# Altium schematic sheet mboard.SchDoc: =GlobalProjectName
size 410 x 297 mm; SheetNumber: 1; SheetTotal: 2; PageSetup: Record=PageOptions|CenterHorizontal=True|CenterVertical=True|PrintScale=1.00|XCorrection=1.00|YCorrection=1.00|PrintKind=1|BorderSize=5000000|LeftOffset=0|BottomOffset=0|Orientation=2|PaperLength=1000|PaperWidth=1000|Scale=100|PaperSource=15|PrintQuality=1200|MediaType=1|DitherType=10|PaperKind=A3|PrintScaleMode=1; Weight: -; ScaleFactor: -
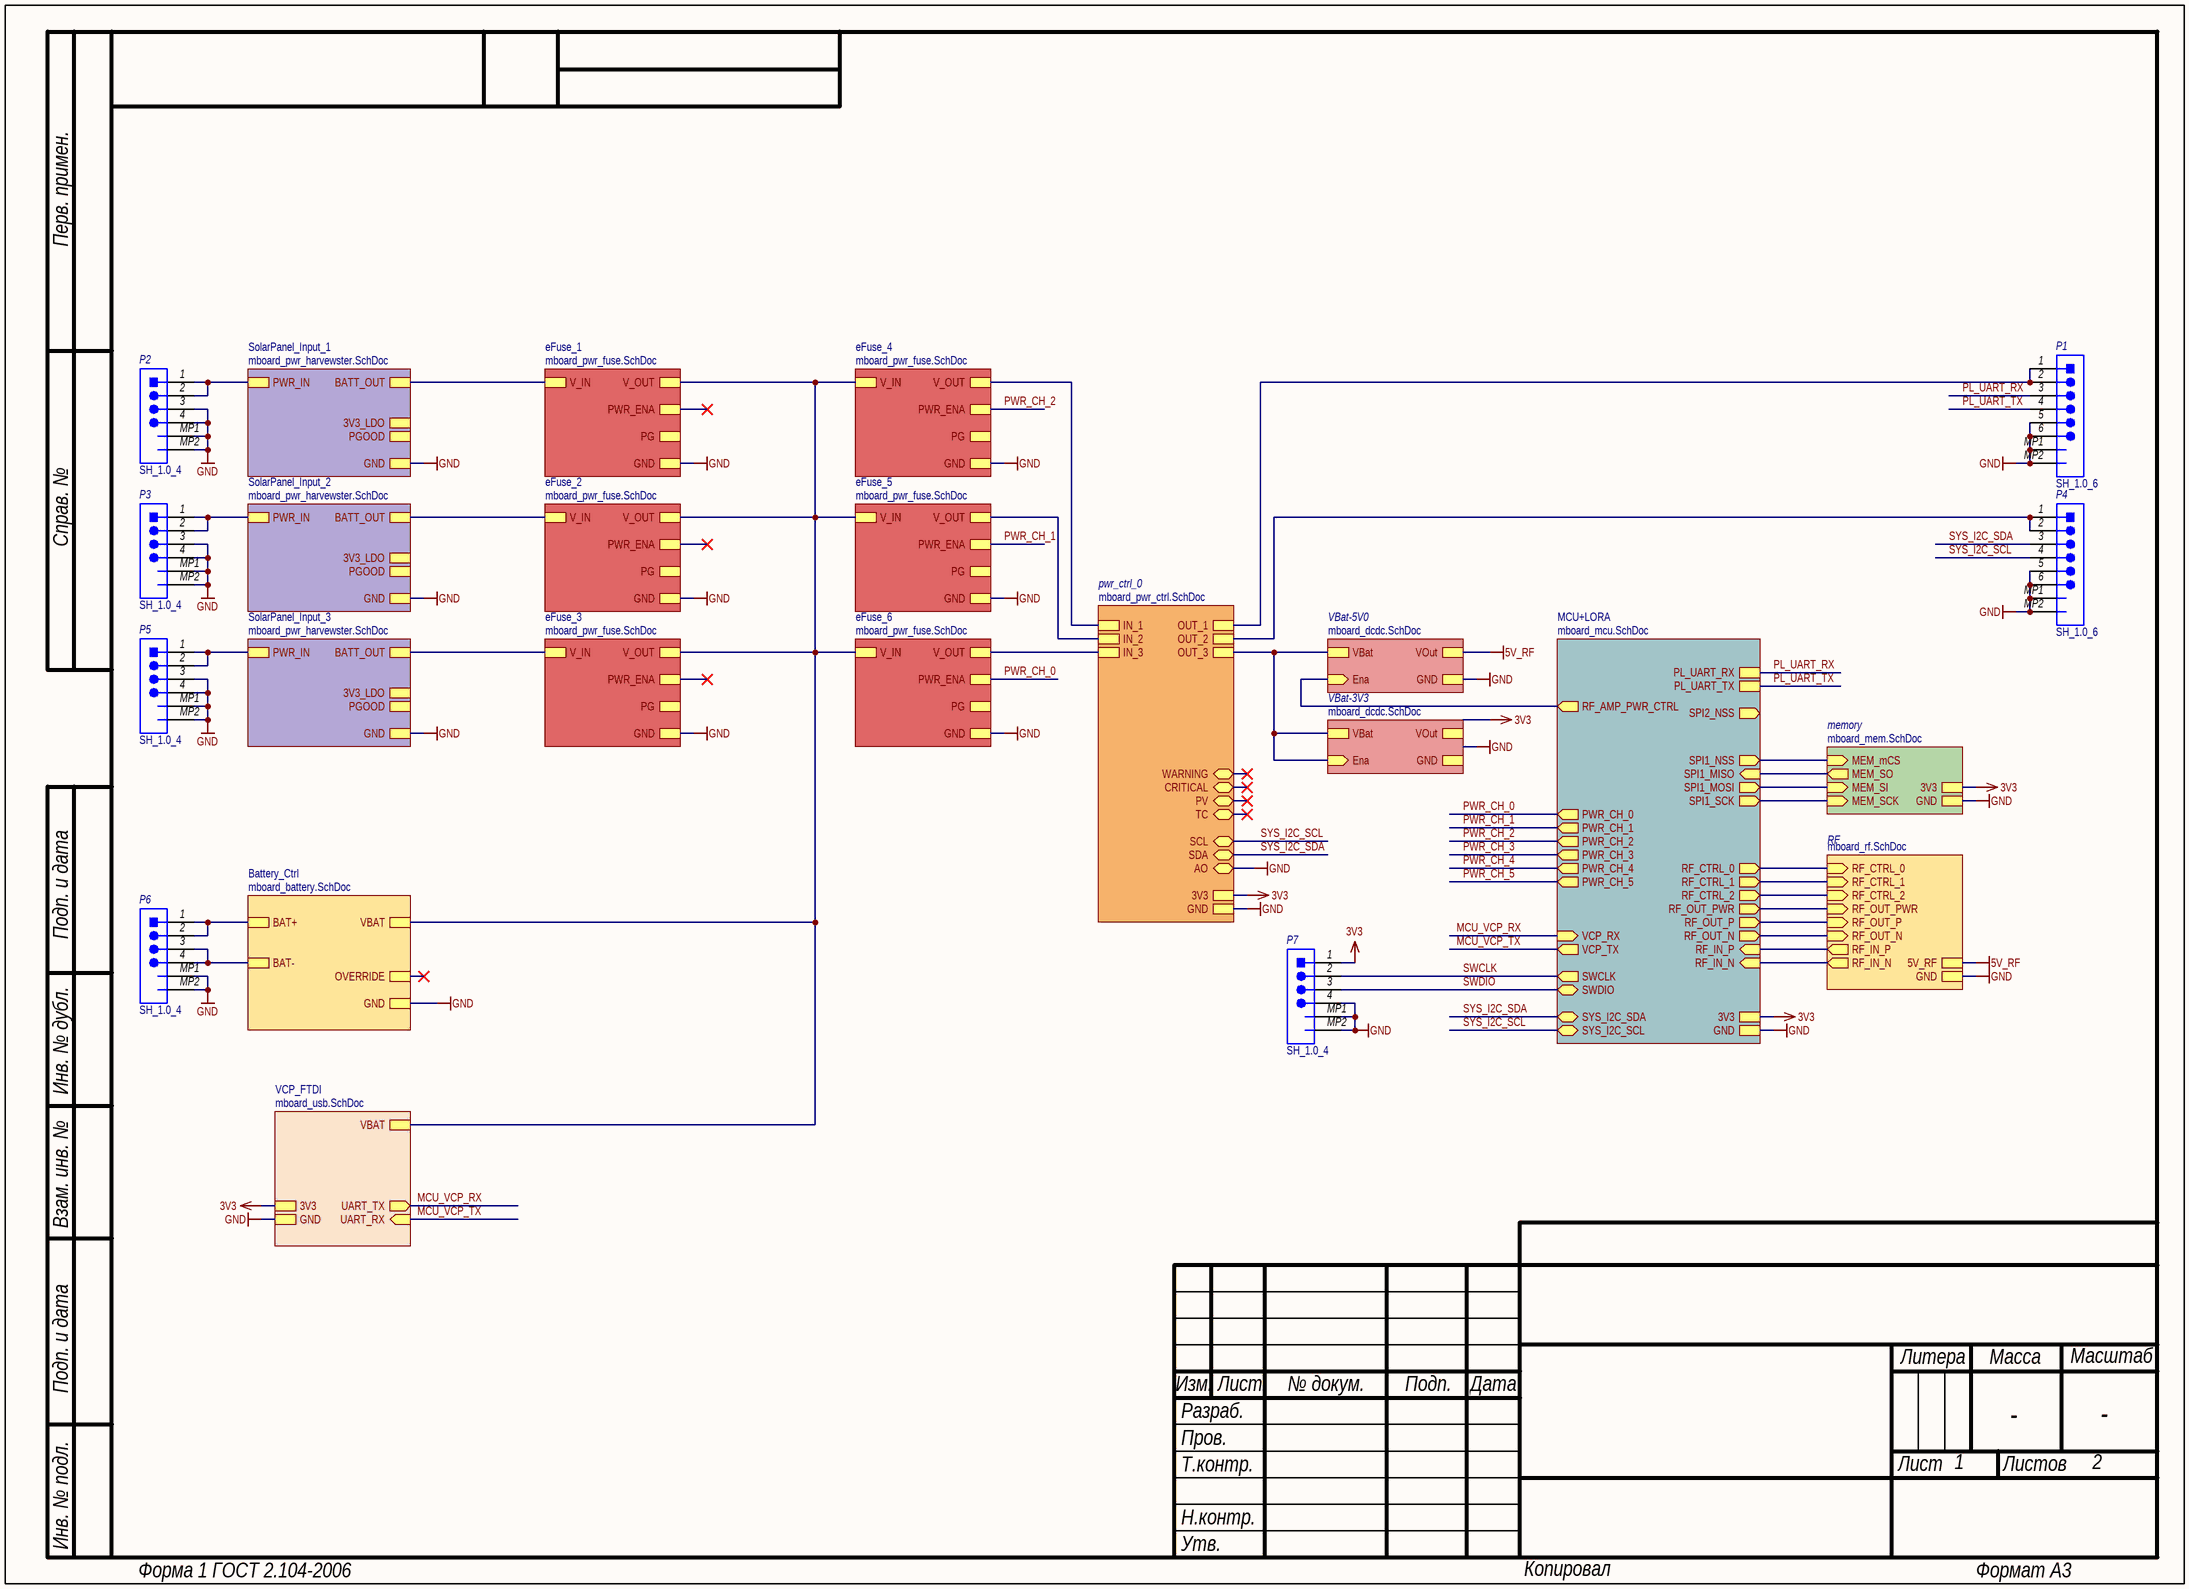
[diagram p0: mboard.SchDoc]

## Parts
P1  SH_1.0_6  [SH_1.0_6]
P2  SH_1.0_4  [SH_1.0_6]
P3  SH_1.0_4  [SH_1.0_6]
P4  SH_1.0_6  [SH_1.0_6]
P5  SH_1.0_4  [SH_1.0_6]
P6  SH_1.0_4  [SH_1.0_6]
P7  SH_1.0_4  [SH_1.0_6]

## Sub-sheets
Battery_Ctrl = mboard_battery.SchDoc: GND, BAT+, VBAT, OVERRIDE, BAT-
eFuse_1 = mboard_pwr_fuse.SchDoc: PG, V_IN, PWR_ENA, GND, V_OUT
eFuse_2 = mboard_pwr_fuse.SchDoc: PG, V_IN, PWR_ENA, GND, V_OUT
eFuse_3 = mboard_pwr_fuse.SchDoc: PG, V_IN, PWR_ENA, GND, V_OUT
eFuse_4 = mboard_pwr_fuse.SchDoc: PG, V_IN, PWR_ENA, GND, V_OUT
eFuse_5 = mboard_pwr_fuse.SchDoc: PG, V_IN, PWR_ENA, GND, V_OUT
eFuse_6 = mboard_pwr_fuse.SchDoc: PG, V_IN, PWR_ENA, GND, V_OUT
MCU+LORA = mboard_mcu.SchDoc: 3V3, GND, PWR_CH_1 (out), PWR_CH_0 (out), PL_UART_RX, VCP_TX (out), PWR_CH_2 (out), SPI1_MISO (in), SPI1_SCK (out), PWR_CH_4 (out), PWR_CH_5 (out), PWR_CH_3 (out), VCP_RX (in), PL_UART_TX, SPI1_MOSI (out), SPI1_NSS (out), SWCLK (out), SWDIO (bidir), SPI2_NSS (out), RF_AMP_PWR_CTRL (out), SYS_I2C_SDA (bidir), SYS_I2C_SCL (bidir), RF_IN_P (in), RF_OUT_P (out), RF_CTRL_2 (out), RF_OUT_N (out), RF_CTRL_0 (out), RF_IN_N (in), RF_OUT_PWR (out), RF_CTRL_1 (out)
memory = mboard_mem.SchDoc: GND, MEM_mCS (in), MEM_SO (out), 3V3, MEM_SI (in), MEM_SCK (in)
pwr_ctrl_0 = mboard_pwr_ctrl.SchDoc: IN_1, WARNING (bidir), AO (bidir), OUT_3, IN_3, CRITICAL (bidir), OUT_2, GND, IN_2, TC (bidir), SCL (bidir), SDA (bidir), OUT_1, 3V3, PV (bidir)
RF = mboard_rf.SchDoc: RF_OUT_PWR (in), RF_CTRL_2 (in), RF_CTRL_0 (in), RF_IN_N (out), RF_OUT_P (in), RF_OUT_N (in), RF_CTRL_1 (in), RF_IN_P (out), GND, 5V_RF
SolarPanel_Input_1 = mboard_pwr_harvewster.SchDoc: PGOOD, GND, PWR_IN, BATT_OUT, 3V3_LDO
SolarPanel_Input_2 = mboard_pwr_harvewster.SchDoc: PGOOD, GND, PWR_IN, BATT_OUT, 3V3_LDO
SolarPanel_Input_3 = mboard_pwr_harvewster.SchDoc: PGOOD, GND, PWR_IN, BATT_OUT, 3V3_LDO
VBat-3V3 = mboard_dcdc.SchDoc: VBat, Ena (in), VOut, GND  | DCDC_Name: TPS621221
VBat-5V0 = mboard_dcdc.SchDoc: VBat, Ena (in), VOut, GND  | DCDC_Name: TPS621222
VCP_FTDI = mboard_usb.SchDoc: UART_RX (in), GND, 3V3, VBAT, UART_TX (out)

## Nets
3V3: P7.1 ; sheet MCU+LORA/3V3, sheet VCP_FTDI/3V3, sheet pwr_ctrl_0/3V3, sheet memory/3V3
5V_RF: sheet RF/5V_RF, sheet VBat-5V0/VOut
GND: P1.5 P1.6 P1.MP1 P1.MP2 P2.3 P2.4 P2.MP1 P2.MP2 P3.3 P3.4 P3.MP1 P3.MP2 P4.5 P4.6 P4.MP1 P4.MP2 P5.3 P5.4 P5.MP1 P5.MP2 P6.MP1 P6.MP2 P7.4 P7.MP1 P7.MP2 ; sheet MCU+LORA/GND, sheet VCP_FTDI/GND, sheet SolarPanel_Input_1/GND, sheet Battery_Ctrl/GND, sheet SolarPanel_Input_2/GND, sheet SolarPanel_Input_3/GND, sheet eFuse_1/GND, sheet eFuse_2/GND, sheet eFuse_3/GND, sheet eFuse_4/GND, sheet eFuse_5/GND, sheet eFuse_6/GND, sheet RF/GND, sheet VBat-5V0/GND, sheet pwr_ctrl_0/AO, sheet pwr_ctrl_0/GND, sheet memory/GND
MCU_VCP_RX: sheet MCU+LORA/VCP_RX, sheet VCP_FTDI/UART_TX
MCU_VCP_TX: sheet MCU+LORA/VCP_TX, sheet VCP_FTDI/UART_RX
PL_UART_RX: P1.3 ; sheet MCU+LORA/PL_UART_RX
PL_UART_TX: P1.4 ; sheet MCU+LORA/PL_UART_TX
PWR_CH_0: sheet MCU+LORA/PWR_CH_0, sheet eFuse_6/PWR_ENA
PWR_CH_1: sheet MCU+LORA/PWR_CH_1, sheet eFuse_5/PWR_ENA
PWR_CH_2: sheet MCU+LORA/PWR_CH_2, sheet eFuse_4/PWR_ENA
PWR_CH_3: sheet MCU+LORA/PWR_CH_3
PWR_CH_4: sheet MCU+LORA/PWR_CH_4
PWR_CH_5: sheet MCU+LORA/PWR_CH_5
SWCLK: P7.2 ; sheet MCU+LORA/SWCLK
SWDIO: P7.3 ; sheet MCU+LORA/SWDIO
SYS_I2C_SCL: P4.4 ; sheet MCU+LORA/SYS_I2C_SCL, sheet pwr_ctrl_0/SCL
SYS_I2C_SDA: P4.3 ; sheet MCU+LORA/SYS_I2C_SDA, sheet pwr_ctrl_0/SDA
NetP1_1: P1.1 P1.2 ; sheet pwr_ctrl_0/OUT_1
NetP2_1: P2.1 P2.2 ; sheet SolarPanel_Input_1/PWR_IN
NetP3_1: P3.1 P3.2 ; sheet SolarPanel_Input_2/PWR_IN
NetP4_1: P4.1 P4.2 ; sheet pwr_ctrl_0/OUT_2
NetP5_1: P5.1 P5.2 ; sheet SolarPanel_Input_3/PWR_IN
NetP6_1: P6.1 P6.2 ; sheet Battery_Ctrl/BAT+
NetP6_3: P6.3 P6.4 ; sheet Battery_Ctrl/BAT-
(unnamed): sheet MCU+LORA/SPI1_MISO, sheet memory/MEM_SO
(unnamed): sheet MCU+LORA/SPI1_SCK, sheet memory/MEM_SCK
(unnamed): sheet MCU+LORA/SPI1_MOSI, sheet memory/MEM_SI
(unnamed): sheet MCU+LORA/SPI1_NSS, sheet memory/MEM_mCS
(unnamed): sheet MCU+LORA/RF_AMP_PWR_CTRL, sheet VBat-5V0/Ena
(unnamed): sheet MCU+LORA/RF_IN_P, sheet RF/RF_IN_P
(unnamed): sheet MCU+LORA/RF_OUT_P, sheet RF/RF_OUT_P
(unnamed): sheet MCU+LORA/RF_CTRL_2, sheet RF/RF_CTRL_2
(unnamed): sheet MCU+LORA/RF_OUT_N, sheet RF/RF_OUT_N
(unnamed): sheet MCU+LORA/RF_CTRL_0, sheet RF/RF_CTRL_0
(unnamed): sheet MCU+LORA/RF_IN_N, sheet RF/RF_IN_N
(unnamed): sheet MCU+LORA/RF_OUT_PWR, sheet RF/RF_OUT_PWR
(unnamed): sheet MCU+LORA/RF_CTRL_1, sheet RF/RF_CTRL_1
(unnamed): sheet VCP_FTDI/VBAT, sheet Battery_Ctrl/VBAT, sheet eFuse_1/V_OUT, sheet eFuse_2/V_OUT, sheet eFuse_3/V_OUT, sheet eFuse_4/V_IN, sheet eFuse_5/V_IN, sheet eFuse_6/V_IN
(unnamed): sheet SolarPanel_Input_1/BATT_OUT, sheet eFuse_1/V_IN
(unnamed): sheet SolarPanel_Input_2/BATT_OUT, sheet eFuse_2/V_IN
(unnamed): sheet SolarPanel_Input_3/BATT_OUT, sheet eFuse_3/V_IN
(unnamed): sheet eFuse_4/V_OUT, sheet pwr_ctrl_0/IN_1
(unnamed): sheet eFuse_5/V_OUT, sheet pwr_ctrl_0/IN_2
(unnamed): sheet eFuse_6/V_OUT, sheet pwr_ctrl_0/IN_3
(unnamed): sheet VBat-5V0/VBat, sheet VBat-3V3/VBat, sheet VBat-3V3/Ena, sheet pwr_ctrl_0/OUT_3

## Notes on the sheet
- Перв. примен.
- Справ. №
- Подп. и дата
- Инв. № дубл.
- Взам. инв. №
- Изм.
- Разраб.
- Лист
- № докум.
- Подп.
- Дата
- Литера
- Масса
- Масштаб
- Пров.
- Т.контр.
- Листов
- Н.контр.
- Утв.
- Инв. № подл.
- Форма 1 ГОСТ 2.104-2006
- Копировал
- Формат А3

## Library data of the parts
P1 P4 = SH_1.0_6: JST SH1.0, 1.0 mm pitch/Disconnactable crimp style connectors; Потребление, Вт: 0.0; Назначение: JST SH1.0, 1.0 mm pitch/Disconnactable crimp style connectors; ComponentLink1Description: DataSheet; ComponentLink1URL: https://www.jst-mfg.com/product/pdf/eng/eSH.pdf; Наименование: SH_1.0_6
P2 P3 P5-P7 = SH_1.0_4: JST SH1.0, 1.0 mm pitch/Disconnactable crimp style connectors; Потребление, Вт: 0.0; Назначение: JST SH1.0, 1.0 mm pitch/Disconnactable crimp style connectors; ComponentLink1Description: DataSheet; ComponentLink1URL: https://www.jst-mfg.com/product/pdf/eng/eSH.pdf; Наименование: SH_1.0_4